# EAGLE design Board_II (EAGLE 9.0.1)
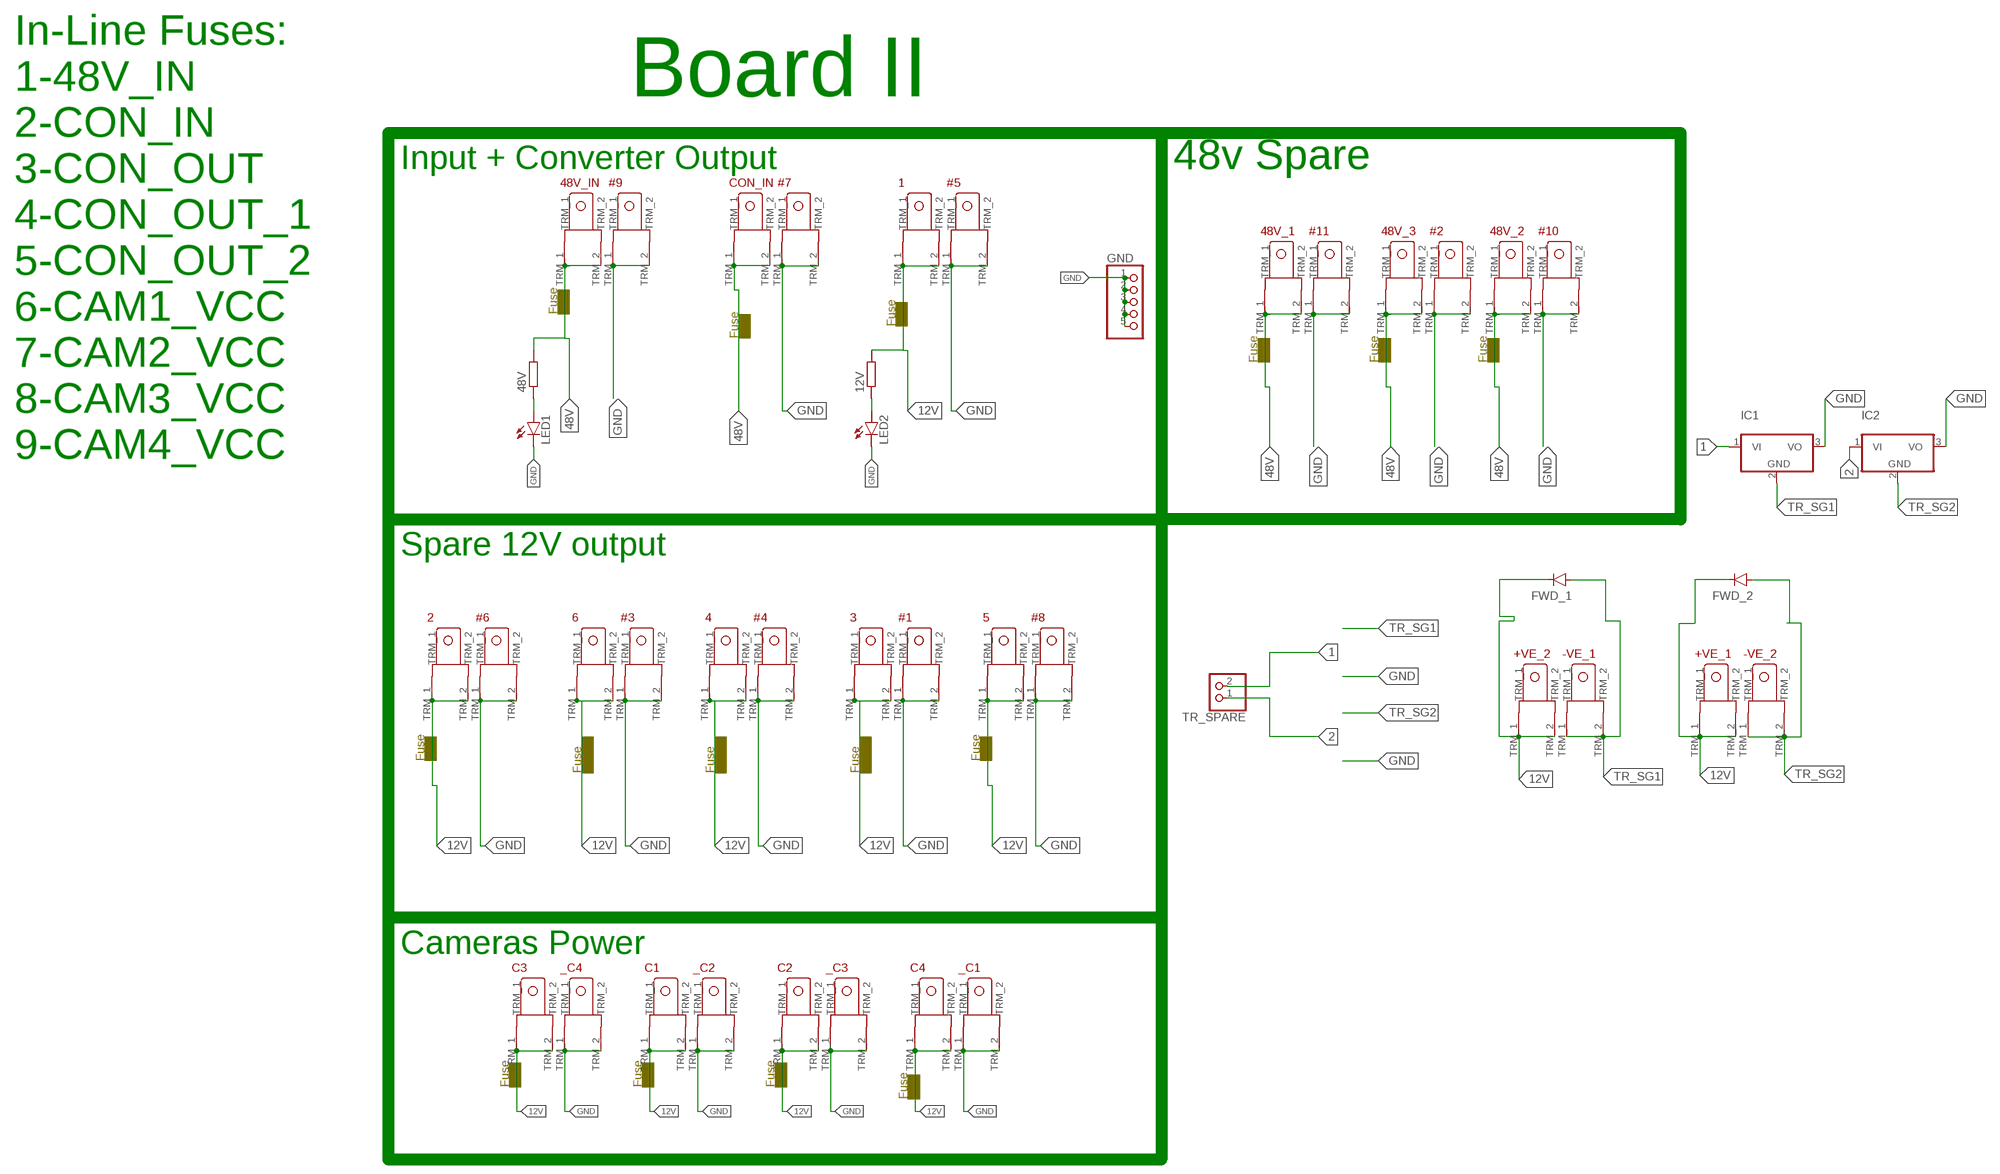
[diagram p0: schematic, sheet 1]

## Parts
1  TERMINAL_EDITED  [TERMINAL_EDITED]
2  TERMINAL_EDITED  [TERMINAL_EDITED]
3  TERMINAL_EDITED  [TERMINAL_EDITED]
4  TERMINAL_EDITED  [TERMINAL_EDITED]
5  TERMINAL_EDITED  [TERMINAL_EDITED]
6  TERMINAL_EDITED  [TERMINAL_EDITED]
12V  RESISTOR  [0207/10]
48V  RESISTOR  [0207/10]
48V_1  TERMINAL_EDITED  [TERMINAL_EDITED]
48V_2  TERMINAL_EDITED  [TERMINAL_EDITED]
48V_3  TERMINAL_EDITED  [TERMINAL_EDITED]
48V_IN  TERMINAL_EDITED  [TERMINAL_EDITED]
#1  TERMINAL_EDITED  [TERMINAL_EDITED]
#2  TERMINAL_EDITED  [TERMINAL_EDITED]
#3  TERMINAL_EDITED  [TERMINAL_EDITED]
#4  TERMINAL_EDITED  [TERMINAL_EDITED]
#5  TERMINAL_EDITED  [TERMINAL_EDITED]
#6  TERMINAL_EDITED  [TERMINAL_EDITED]
#7  TERMINAL_EDITED  [TERMINAL_EDITED]
#8  TERMINAL_EDITED  [TERMINAL_EDITED]
#9  TERMINAL_EDITED  [TERMINAL_EDITED]
#10  TERMINAL_EDITED  [TERMINAL_EDITED]
#11  TERMINAL_EDITED  [TERMINAL_EDITED]
+VE_1  TERMINAL_EDITED  [TERMINAL_EDITED]
+VE_2  TERMINAL_EDITED  [TERMINAL_EDITED]
-VE_1  TERMINAL_EDITED  [TERMINAL_EDITED]
-VE_2  TERMINAL_EDITED  [TERMINAL_EDITED]
_C1  TERMINAL_EDITED  [TERMINAL_EDITED]
_C2  TERMINAL_EDITED  [TERMINAL_EDITED]
_C3  TERMINAL_EDITED  [TERMINAL_EDITED]
_C4  TERMINAL_EDITED  [TERMINAL_EDITED]
C1  TERMINAL_EDITED  [TERMINAL_EDITED]
C2  TERMINAL_EDITED  [TERMINAL_EDITED]
C3  TERMINAL_EDITED  [TERMINAL_EDITED]
C4  TERMINAL_EDITED  [TERMINAL_EDITED]
CON_IN  TERMINAL_EDITED  [TERMINAL_EDITED]
FWD_1  DIODE  [DO35-10]
FWD_2  DIODE  [DO35-10]
GND  PINHD-1X5  [1X05]
IC1  7805_REG  [TO220V]
IC2  7805_REG  [TO220V]
LED1  LED5MM  [LED5MM]
LED2  LED5MM  [LED5MM]
TR_SPARE  PINHD-1X2  [1X02]

## Nets
1: IC1.1(VI) TR_SPARE.2
2: IC2.1(VI) TR_SPARE.1
12V: 1.TRM_1 1.TRM_2 2.TRM_1 2.TRM_2 3.TRM_1 3.TRM_2 4.TRM_1 4.TRM_2 5.TRM_1 5.TRM_2 6.TRM_1 6.TRM_2 12V.2 +VE_1.TRM_1 +VE_1.TRM_2 +VE_2.TRM_1 +VE_2.TRM_2 C1.TRM_1 C1.TRM_2 C2.TRM_1 C2.TRM_2 C3.TRM_1 C3.TRM_2 C4.TRM_1 C4.TRM_2 FWD_1.C FWD_2.C
48V: 48V.2 48V_1.TRM_1 48V_1.TRM_2 48V_2.TRM_1 48V_2.TRM_2 48V_3.TRM_1 48V_3.TRM_2 48V_IN.TRM_1 48V_IN.TRM_2 CON_IN.TRM_1 CON_IN.TRM_2
GND: #1.TRM_1 #1.TRM_2 #2.TRM_1 #2.TRM_2 #3.TRM_1 #3.TRM_2 #4.TRM_1 #4.TRM_2 #5.TRM_1 #5.TRM_2 #6.TRM_1 #6.TRM_2 #7.TRM_1 #7.TRM_2 #8.TRM_1 #8.TRM_2 #9.TRM_1 #9.TRM_2 #10.TRM_1 #10.TRM_2 #11.TRM_1 #11.TRM_2 _C1.TRM_1 _C1.TRM_2 _C2.TRM_1 _C2.TRM_2 _C3.TRM_1 _C3.TRM_2 _C4.TRM_1 _C4.TRM_2 GND.1 GND.2 GND.3 GND.4 GND.5 IC1.3(VO) IC2.3(VO) LED1.K(C) LED2.K(C)
N$4: 48V.1 LED1.A
N$8: 12V.1 LED2.A
TR_SG1: -VE_1.TRM_1 -VE_1.TRM_2 FWD_1.A IC1.2(GND)
TR_SG2: -VE_2.TRM_1 -VE_2.TRM_2 FWD_2.A IC2.2(GND)

## Notes on the sheet
- Board II
- Input + Converter Output | 48v Spare
- Fuse
- Fuse
- Fuse
- Fuse | Fuse | Fuse
- In-Line Fuses:
  1-48V_IN
  2-CON_IN
  3-CON_OUT
  4-CON_OUT_1
  5-CON_OUT_2
  6-CAM1_VCC
  7-CAM2_VCC
  8-CAM3_VCC
  9-CAM4_VCC
- Spare 12V output
- Fuse | Fuse
- Fuse | Fuse | Fuse
- Cameras Power
- Fuse | Fuse | Fuse
- Fuse

## Library data of the parts
1-6 48V_1-48V_3 48V_IN #1-#11 +VE_1 +VE_2 -VE_1 -VE_2 _C1-_C4 C1-C4 CON_IN = 1-ROV Components:TERMINAL_EDITED
12V 48V = 1-ROV Components:RESISTOR
FWD_1 FWD_2 = 1-ROV Components:DIODE
GND = pinhead:PINHD-1X5: PIN HEADER
IC1 IC2 = 1-ROV Components:7805_REG
LED1 LED2 = led:LED: LED OSRAM: - CHIPLED LG R971, LG N971, LY N971, LG Q971, LY Q971, LO R971, LY R971 LH N974, LH R974 LS Q976, LO Q976, LY Q976 LO Q996 - Hyper CHIPLED LW Q18S LB Q993, LB Q99A, LB R99A - SideLED LS A670, LO A670, LY A670, LG A670, LP A670 LB A673, LV A673, LT A673, LW A673 LH A674 LY A675 LS A676, LA A676, LO A676, LY A676, LW A676 LS A679, LY A679, LG A679 - Hyper Micro SIDELED® LS Y876, LA Y876, LO Y876, LY Y876 LT Y87S - SmartLED LW L88C, LW L88S LB L89C, LB L89S, LG L890 LS L89K, LO L89K, LY L89K LS L896, LA L896, LO L896, LY L896 - TOPLED LS T670, LO T670, LY T670, LG T670, LP T670 LSG T670, LSP T670, LSY T670, LOP T670, LYG T670 LG T671, LOG T671, LSG T671 LB T673, LV T673, LT T673, LW T673 LH T674 LS T676, LA T676, LO T676, LY T676, LB T676, LH T676, LSB T676, LW T676 LB T67C, LV T67C, LT T67C, LS T67K, LO T67K, LY T67K, LW E67C LS E67B, LA E67B, LO E67B, LY E67B, LB E67C, LV E67C, LT E67C LW T67C LS T679, LY T679, LG T679 LS T770, LO T770, LY T770, LG T770, LP T770 LB T773, LV T773, LT T773, LW T773 LH T774 LS E675, LA E675, LY E675, LS T675 LS T776, LA T776, LO T776, LY T776, LB T776 LHGB T686 LT T68C, LB T68C - Hyper Mini TOPLED® LB M676 - Mini TOPLED Santana® LG M470 LS M47K, LO M47K, LY M47K Source: http://www.osram.convergy.de LUXEON: - LUMILED® LXK2-PW12-R00, LXK2-PW12-S00, LXK2-PW14-U00, LXK2-PW14-V00 LXK2-PM12-R00, LXK2-PM12-S00, LXK2-PM14-U00 LXK2-PE12-Q00, LXK2-PE12-R00, LXK2-PE12-S00, LXK2-PE14-T00, LXK2-PE14-U00 LXK2-PB12-K00, LXK2-PB12-L00, LXK2-PB12-M00, LXK2-PB14-N00, LXK2-PB14-P00, LXK2-PB14-Q00 LXK2-PR12-L00, LXK2-PR12-M00, LXK2-PR14-Q00, LXK2-PR14-R00 LXK2-PD12-Q00, LXK2-PD12-R00, LXK2-PD12-S00 LXK2-PH12-R00, LXK2-PH12-S00 LXK2-PL12-P00, LXK2-PL12-Q00, LXK2-PL12-R00 Source: www.luxeon.com KINGBRIGHT: KA-3528ASYC Source: www.kingbright.com
TR_SPARE = pinhead:PINHD-1X2: PIN HEADER

## Board
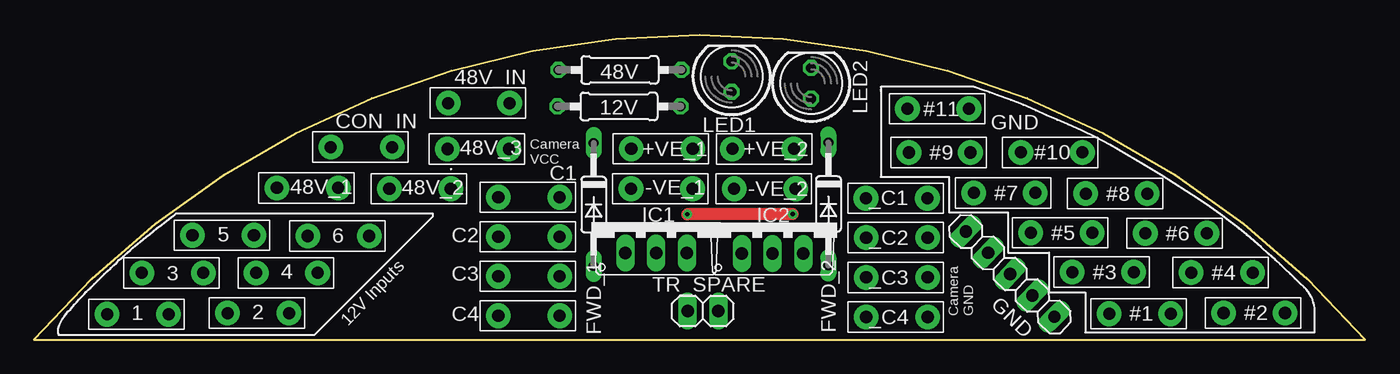
[diagram p1: board, top side]
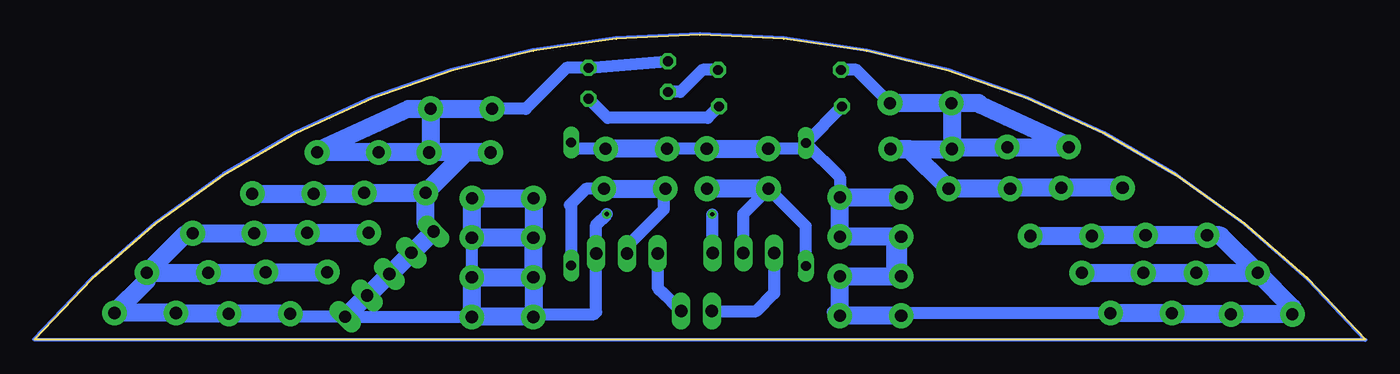
[diagram p2: board, bottom side, seen from below]

Size 110 x 25.17 mm. Coordinates in mm from the lower left corner, seen from the top.
Outline: 0,0 arc-98 110,0 0,0
Copper layers (1*16): Top 0.035mm / dielectric 1.5mm / Bottom 0.035mm
Design rules "default": minimum track width 6mil, minimum drill 0.35mm, track to track 6mil, track to pad 6mil, pad to pad 6mil, via to via 6mil, smd to smd 6mil, copper to edge 40mil, drill to drill 6mil, minimum pad ring 10mil, minimum via ring 8mil, stop-mask expansion 4mil, vias tented up to drill 0mil, thermal gap 10mil

### Footprints (pad centres in the part's own frame; a part is rotated, then mirrored left to right if it is on the bottom)
TERMINAL_EDITED = drill 1 pad 2.032: TRM_1 -2.54,0; TRM_2 2.54,0
0207/10 = drill 0.813 octagon: 1 -5.08,0; 2 5.08,0
DO35-10 = drill 0.813 long: A 5.08,0; C -5.08,0
1X05 = drill 1.016 long: 1 -5.08,0; 2 -2.54,0; 3 0,0; 4 2.54,0; 5 5.08,0
TO220V = drill 1.016 long: 1 -2.54,-2.54; 2 0,-2.54; 3 2.54,-2.54
LED5MM = drill 0.813 octagon: A -1.27,0; K 1.27,0
1X02 = drill 1.016 long: 1 -1.27,0; 2 1.27,0

### Placement (x,y rotation side)
1  8.58,2.1 0 top
2  18.53,2.18 0 top
3  11.45,5.51 0 top
4  20.9,5.51 0 top
5  15.63,8.62 0 top
6  25.17,8.56 0 top
12V  48.34,19.26 180 top
48V  48.42,22.28 180 top
48V_1  22.61,12.53 0 top
48V_2  31.91,12.46 0 top
48V_3  36.71,15.74 0 top
48V_IN  36.77,19.54 0 top
#1  91.4,2.14 0 top
#2  100.85,2.2 0 top
#3  88.34,5.58 0 top
#4  98.17,5.53 0 top
#5  84.91,8.82 0 top
#6  94.38,8.79 0 top
#7  80.2,12.12 0 top
#8  89.46,12.06 0 top
#9  74.85,15.46 0 top
#10  84.1,15.47 0 top
#11  74.73,19.07 0 top
+VE_1  51.9,15.76 0 top
+VE_2  60.26,15.76 180 top
-VE_1  51.88,12.46 0 top
-VE_2  60.4,12.46 0 top
_C1  71.3,11.68 0 top
_C2  71.31,8.43 0 top
_C3  71.31,5.14 0 top
_C4  71.31,1.87 0 top
C1  40.91,11.76 0 top
C2  40.91,8.5 0 top
C3  40.91,5.24 0 top
C4  40.91,1.97 0 top
CON_IN  27.07,15.9 0 top
FWD_1  46.25,11.16 270 top
FWD_2  65.65,11.2 270 top
GND  80.67,5.41 136 top
IC1  51.42,9.69 0 top
IC2  61.03,9.66 0 top
LED1  57.65,21.73 90 top
LED2  64.22,21.17 90 top
TR_SPARE  55.29,2.36 180 top

### Tracks (layer width: path | path; a pad name or v marks a point on that pad's centre or on a via)
1
  Bottom 1: TR_SPARE.2 50.34,2.36 48.88,3.82 48.88,6.04 IC1.1
2
  Bottom 1: TR_SPARE.1 57.37,3.17 57.9,3.7 58.49,4.29 IC2.1
12V
  Bottom 1: 1.TRM_2 11.12,2.64 | 18.36,8.43 5.TRM_2 | 2.TRM_2 38.16,2.18 C4.TRM_1 | 44.01,2.26 43.72,1.97 C4.TRM_2 | C3.TRM_1 C2.TRM_1 38.83,8.5 43.06,8.5 C2.TRM_2 43.45,11.73 43.48,11.76 | 43.87,12.15 43.48,11.76 | 43.48,11.76 C1.TRM_2 43.45,13.44 FWD_1.C | 12V.2 46.25,16.27 FWD_1.C | FWD_1.C 46.73,15.76 +VE_1.TRM_1 | +VE_1.TRM_2 +VE_2.TRM_2 | +VE_2.TRM_1 65.13,15.76 FWD_2.C | 15.9,2.1 2.TRM_1 | 8.91,4.97 3.TRM_1 | 12.02,8.62 5.TRM_1 | 22.57,8.62 6.TRM_1
  Bottom 1.5: 15.9,2.1 1.TRM_2 1.TRM_1 6.04,2.64 3.TRM_1 | 2.TRM_1 2.TRM_2 | 4.TRM_2 4.TRM_1 3.TRM_2 3.TRM_1 | 3.TRM_1 11.96,8.55 12.03,8.6 12.05,8.62 5.TRM_1 5.TRM_2 22.57,8.62 | 6.TRM_1 6.TRM_2 | C4.TRM_1 C4.TRM_2 C3.TRM_2 C3.TRM_1 38.83,5.69 38.83,8.5 | C2.TRM_1 43.06,8.5 | C2.TRM_2 C1.TRM_2 C1.TRM_1 | +VE_1.TRM_2 +VE_1.TRM_1 | +VE_2.TRM_2 +VE_2.TRM_1
48V
  Bottom 1: 29.3,12.53 48V_2.TRM_1 | CON_IN.TRM_2 30.6,15.9 | 48V_IN.TRM_2 42.05,22.28 48V.2
  Bottom 1.5: 48V_1.TRM_1 48V_1.TRM_2 29.3,12.53 | 48V_2.TRM_1 48V_2.TRM_2 37.73,15.74 48V_3.TRM_2 48V_3.TRM_1 | 48V_3.TRM_1 34.01,15.9 CON_IN.TRM_2 CON_IN.TRM_1 24.78,16.15 31.8,19.37 31.97,19.54 48V_IN.TRM_1 | 48V_IN.TRM_1 48V_IN.TRM_2 | 48V_IN.TRM_1 34.17,19.48 48V_3.TRM_1
GND  (via drill 0.35)
  Top 1: v62.7,10.37 54.02,10.37 v54,10.35
  Bottom 1: LED1.K 57.76,23 LED2.K 66.03,22.44 69.41,19.07 #11.TRM_1 | _C3.TRM_2 _C2.TRM_2 | 73.85,11.67 _C1.TRM_2 | 98.24,2.14 #2.TRM_1 | 102.9,2.2 #2.TRM_2 | 90.93,5.53 #3.TRM_2 | 97.46,8.79 #6.TRM_2 | 82.8,12.06 #7.TRM_2 | 77.27,15.59 #9.TRM_2 | GND.1 82.56,3.65 GND.2 80.74,5.41 GND.3 | 78.78,7.18 GND.4 | GND.1 88.61,1.88 #1.TRM_1 | GND.1 73.87,1.88 _C4.TRM_2 _C4.TRM_1 68.54,2.1 63.74,2.1 63.57,2.27 IC2.3 63.57,9.49 v62.7,10.37 | v54,10.35 54,7.19 IC1.3
  Bottom 1.5: 73.87,1.88 68.79,1.88 _C4.TRM_1 _C3.TRM_1 | _C4.TRM_2 _C3.TRM_2 _C3.TRM_1 | _C3.TRM_1 _C2.TRM_1 | _C2.TRM_1 _C2.TRM_2 73.85,11.67 | _C1.TRM_2 _C1.TRM_1 68.77,11.67 _C2.TRM_1 | #7.TRM_1 74.32,15.46 #9.TRM_1 #9.TRM_2 #10.TRM_1 #10.TRM_2 86.34,15.76 79.12,19.07 #11.TRM_2 | #7.TRM_1 77.66,9.59 GND.5 78.78,7.18 | GND.4 80.61,5.41 GND.3 82.44,3.65 82.56,3.65 | GND.2 84.27,1.88 GND.1 | #1.TRM_1 #1.TRM_2 98.24,2.14 | #2.TRM_1 102.9,2.2 | #2.TRM_2 100.71,4.88 #4.TRM_2 | #4.TRM_2 #4.TRM_1 90.93,5.53 | #3.TRM_2 #3.TRM_1 | #6.TRM_2 #6.TRM_1 91.8,8.82 #5.TRM_2 #5.TRM_1 | #4.TRM_2 97.46,8.79 | #8.TRM_2 #8.TRM_1 82.8,12.06 | #7.TRM_2 #7.TRM_1 | #11.TRM_2 #11.TRM_1 | #11.TRM_2 77.27,15.59
N$1
  Bottom 0.3: -0.01,0 109.99,0
N$2
  Bottom 0.3: 0.01,-0.04 arc-99 110.05,0.03
N$4
  Bottom 1: 48V.1 54.79,22.28 56.61,20.46 LED1.A
N$8
  Bottom 1: 12V.1 54.36,18.32 62.64,18.32 LED2.A
TR_SG1
  Bottom 1: FWD_1.A 46.25,9.38 -VE_1.TRM_1 51,10.8 51.38,10.43 51.42,10.39 IC1.2
  Bottom 1.5: -VE_1.TRM_1 -VE_1.TRM_2
TR_SG2
  Bottom 1: -VE_2.TRM_2 64.44,12.46 65.78,11.12 65.65,10.99 FWD_2.A | 57.98,12.58 57.98,10.76 61.03,7.71 IC2.2 | 57.98,12.98 57.98,12.58 | 57.98,12.58 -VE_2.TRM_1
  Bottom 1.5: -VE_2.TRM_2 -VE_2.TRM_1

### Text on the board
tNames: GND | Camera / VCC | 12V Inputs | Camera / GND